# Altium schematic sheet USB-IRIS-W1_INTERFACE.SchDoc
size A3; Date: 7/24/2020; CompanyName: U-blox; DrawnBy: EMOO; Engineer: EMOO; Organization: U-blox; Address1: 3950 Fairview Industrial Dr SE #100; Address2: Salem, OR 97302; DocumentNumber: 3; SheetNumber: 3; SheetTotal: 4; SheetSize: B; SheetTitle: Connectors
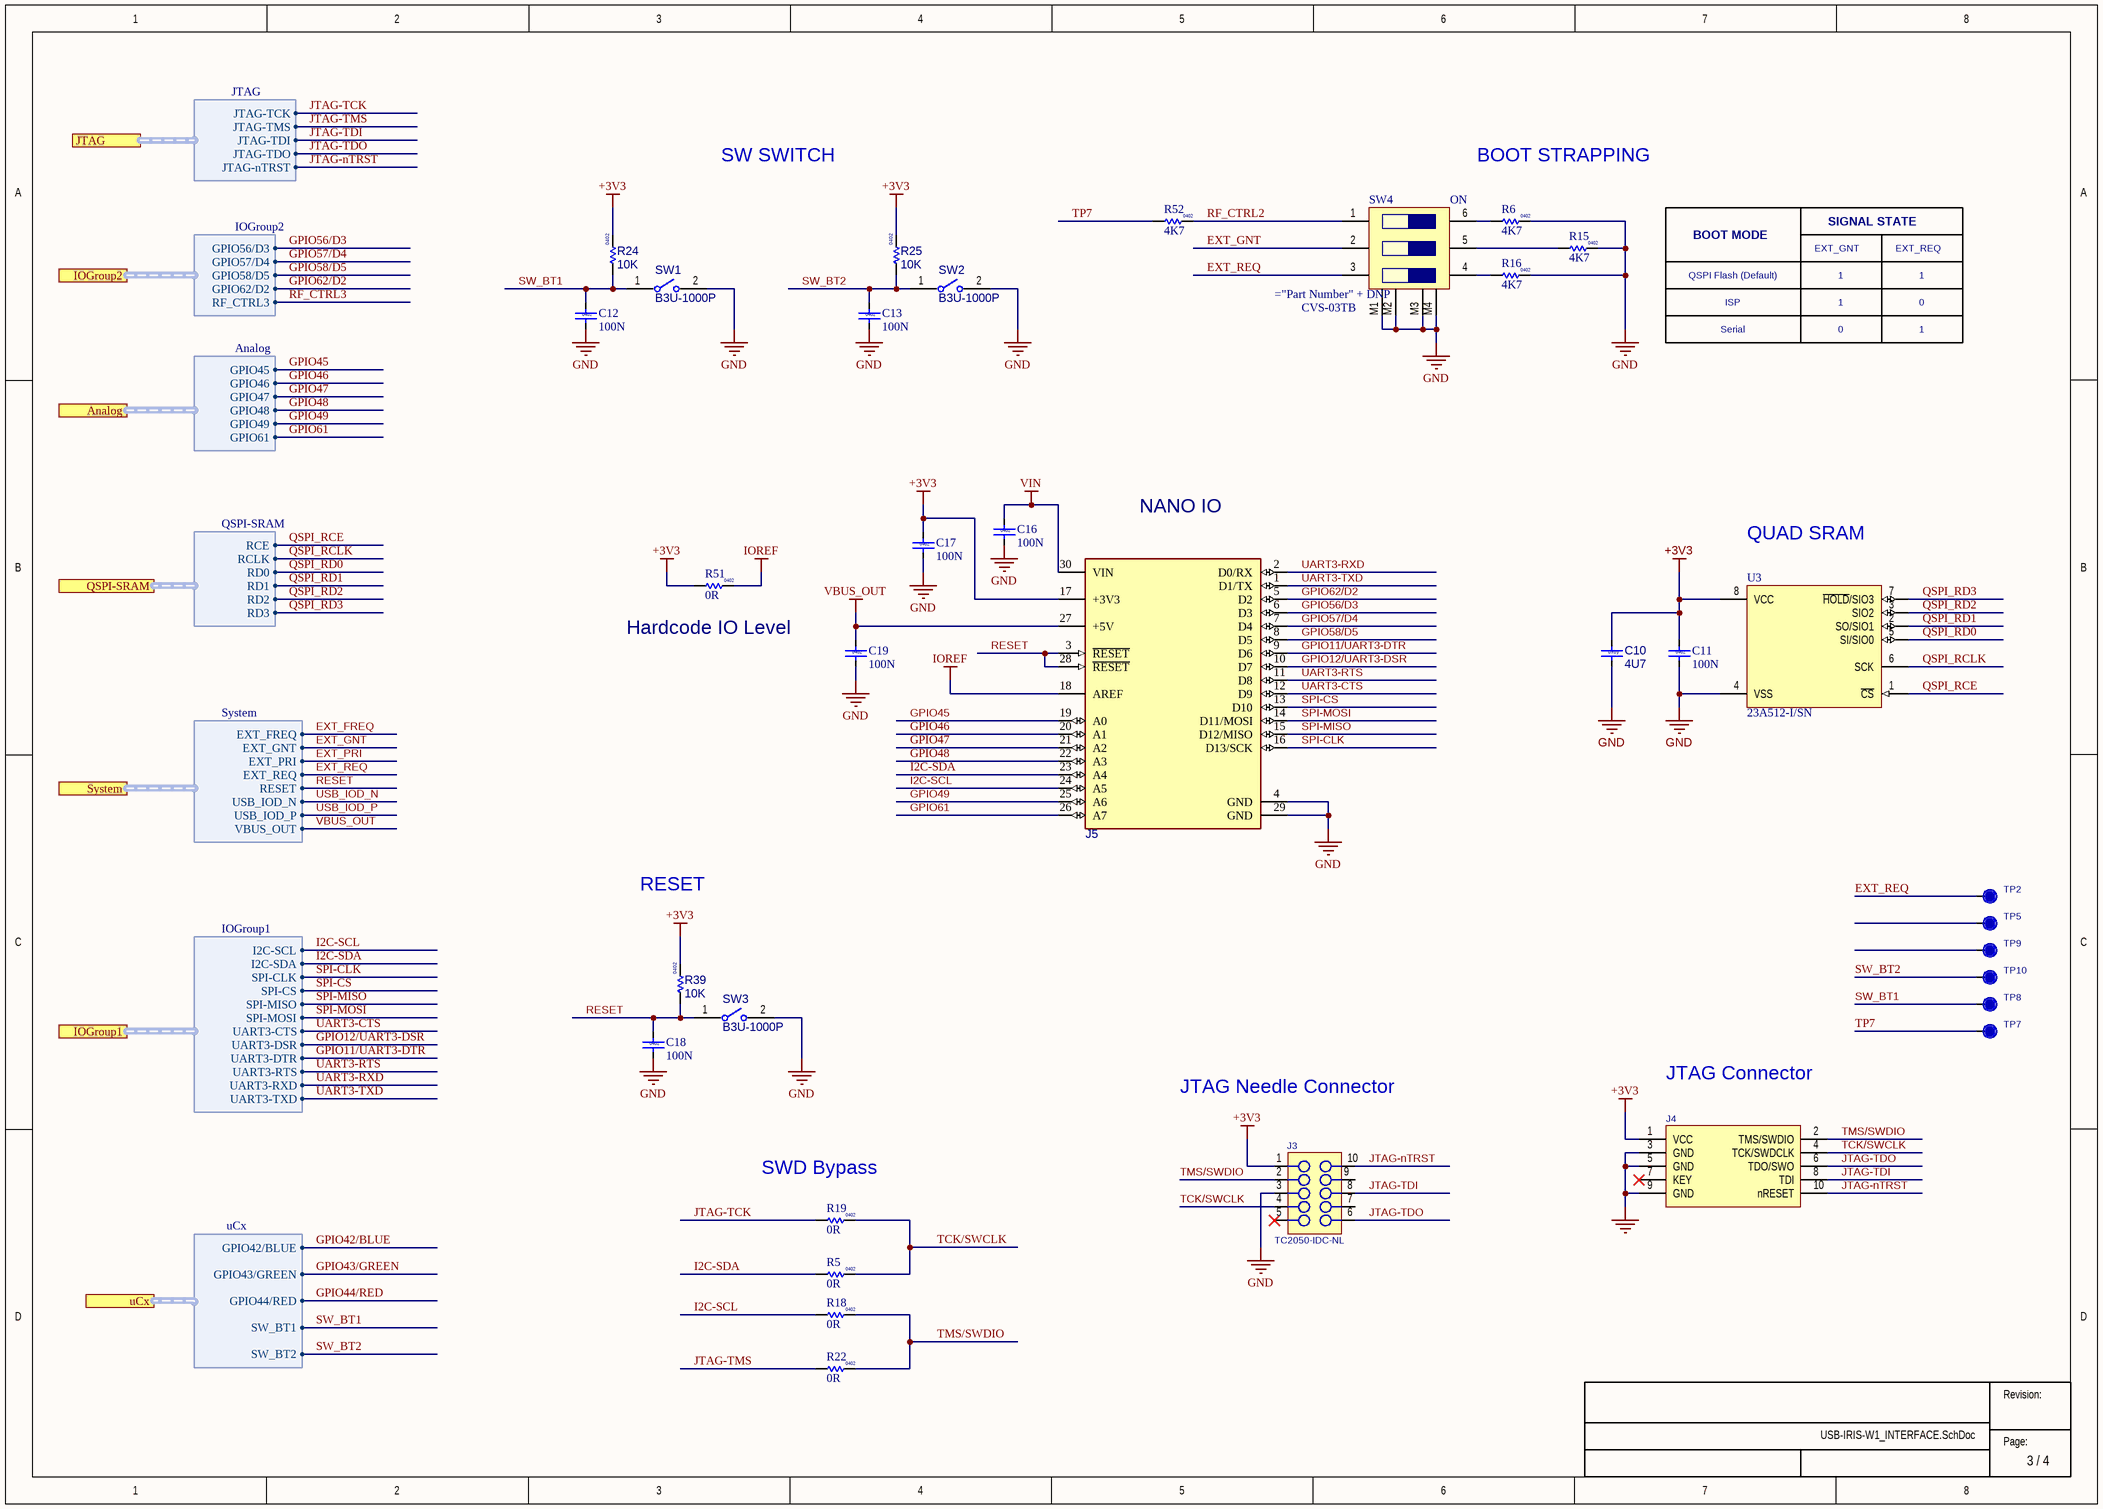
[diagram p0: USB-IRIS-W1_INTERFACE.SchDoc]

## Parts
C10  value 4U7  Size: 0x0y  [Cap 0402 HD]  (no BOM)
C11  value 100N  Size: 0402  [Cap 0402 HD]
C12  value 100N  Size: 0402  [Cap 0402]
C13  value 100N  Size: 0402  [Cap 0402]
C16  value 100N  Size: 0402  [Cap 0402 HD]
C17  value 100N  Size: 0402  [Cap 0402 HD]
C18  value 100N  Size: 0402  [Cap 0402]
C19  value 100N  Size: 0402  [Cap 0402 HD]
J3  TC2050-IDC-NLDNP  [TC2050-IDC-NL]  (value not drawn)  (no BOM)
J4  130-00099  [HDR.050P-10Pin-2x5-SMT_Key]  (value not drawn)
J5  UNK_Arduino  [UNK_Arduino]  (value not drawn)
R5  value 0R  Size: 0402  [RES_0402_1100Lx600Wx400H_500x600Pad_400G_FLX]
R6  value 4K7  Size: 0402  [RES_0402_1100Lx600Wx400H_500x600Pad_400G_FLX]
R15  value 4K7  Size: 0402  [RES_0402_1100Lx600Wx400H_500x600Pad_400G_FLX]
R16  value 4K7  Size: 0402  [RES_0402_1100Lx600Wx400H_500x600Pad_400G_FLX]
R18  value 0R  Size: 0402  [RES_0402_1100Lx600Wx400H_500x600Pad_400G_FLX]
R19  value 0R  Size: 0402  [RES_0402_1100Lx600Wx400H_500x600Pad_400G_FLX]
R22  value 0R  Size: 0402  [RES_0402_1100Lx600Wx400H_500x600Pad_400G_FLX]
R24  value 10K  Size: 0402  [RES 0402 HD]
R25  value 10K  Size: 0402  [RES 0402 HD]
R39  value 10K  Size: 0402  [RES 0402 HD]
R51  value 0R  Size: 0402  [RES_0402_1100Lx600Wx400H_500x600Pad_400G_FLX]
R52  value 4K7  Size: 0402  [RES_0402_1100Lx600Wx400H_500x600Pad_400G_FLX]
SW1  B3U-1000P  [FP-B3U-1000P-MFG]
SW2  B3U-1000P  [FP-B3U-1000P-MFG]
SW3  B3U-1000P  [FP-B3U-1000P-MFG]
SW4  (no value)  [CVS-03]
TP2  TP  [TP10R]  (value not drawn)  (no BOM)
TP5  TP  [TP10R]  (value not drawn)  (no BOM)
TP7  TP  [TP10R]  (value not drawn)  (no BOM)
TP8  TP  [TP10R]  (value not drawn)  (no BOM)
TP9  TP  [TP10R]  (value not drawn)  (no BOM)
TP10  TP  [TP10R]  (value not drawn)  (no BOM)
U3  23A512-I/SN  [SOIC127P599X173-8N]  (no BOM)

## Ports
Analog (harness Analog), IOGroup1 (harness IOGroup1), IOGroup2 (harness IOGroup2), JTAG (harness JTAG), QSPI-SRAM (harness QSPI-SRAM), System (harness System), uCx (harness uCx)

## Harnesses
JTAG: JTAG-TCK, JTAG-TMS, JTAG-TDI, JTAG-TDO, JTAG-nTRST
QSPI-SRAM: RCE, RCLK, RD0, RD1, RD2, RD3
IOGroup2: GPIO56/D3, GPIO57/D4, GPIO58/D5, GPIO62/D2, RF_CTRL3
Analog: GPIO45, GPIO46, GPIO47, GPIO48, GPIO49, GPIO61
uCx: GPIO42/BLUE, GPIO43/GREEN, GPIO44/RED, SW_BT1, SW_BT2
IOGroup1: I2C-SCL, I2C-SDA, SPI-CLK, SPI-CS, SPI-MISO, SPI-MOSI, UART3-CTS, UART3-DSR, UART3-DTR, UART3-RTS, UART3-RXD, UART3-TXD
System: EXT_FREQ, EXT_GNT, EXT_PRI, EXT_REQ, RESET, USB_IOD_N, USB_IOD_P, VBUS_OUT

## Nets
+3V3: C10.1 C11.1 C17.1 J3.1 J4.1(VCC) J5.17(+3V3) R24.2 R25.2 R39.2 R51.1 U3.8(VCC)
GND: C10.2 C11.2 C12.2 C13.2 C16.2 C17.2 C18.2 C19.2 J3.3 J4.3(GND) J4.5(GND) J4.9(GND) J5.4(GND) J5.29(GND) R6.2 R15.2 R16.2 SW1.2 SW2.2 SW3.2 SW4.M1 SW4.M2 SW4.M3 SW4.M4 U3.4(VSS)
IOREF: J5.18(AREF) R51.2
VBUS_OUT: C19.1 J5.27(+5V) ; port System.VBUS_OUT
VIN: C16.1 J5.30(VIN)
EXT_FREQ: port System.EXT_FREQ
EXT_GNT: SW4.2 ; port System.EXT_GNT
EXT_PRI: port System.EXT_PRI
EXT_REQ: SW4.3 TP2.1 ; port System.EXT_REQ
GPIO11/UART3-DTR: J5.9(D6) ; port IOGroup1.UART3-DTR
GPIO12/UART3-DSR: J5.10(D7) ; port IOGroup1.UART3-DSR
GPIO42/BLUE: port uCx.GPIO42/BLUE
GPIO43/GREEN: port uCx.GPIO43/GREEN
GPIO44/RED: port uCx.GPIO44/RED
GPIO45: J5.19(A0) ; port Analog.GPIO45
GPIO46: J5.20(A1) ; port Analog.GPIO46
GPIO47: J5.21(A2) ; port Analog.GPIO47
GPIO48: J5.22(A3) ; port Analog.GPIO48
GPIO49: J5.25(A6) ; port Analog.GPIO49
GPIO56/D3: J5.6(D3) ; port IOGroup2.GPIO56/D3
GPIO57/D4: J5.7(D4) ; port IOGroup2.GPIO57/D4
GPIO58/D5: J5.8(D5) ; port IOGroup2.GPIO58/D5
GPIO61: J5.26(A7) ; port Analog.GPIO61
GPIO62/D2: J5.5(D2) ; port IOGroup2.GPIO62/D2
I2C-SCL: J5.24(A5) R18.1 ; port IOGroup1.I2C-SCL
I2C-SDA: J5.23(A4) R5.1 ; port IOGroup1.I2C-SDA
JTAG-nTRST: J3.10 J4.10(nRESET) ; port JTAG.JTAG-nTRST
JTAG-TCK: R19.1 ; port JTAG.JTAG-TCK
JTAG-TDI: J3.8 J4.8(TDI) ; port JTAG.JTAG-TDI
JTAG-TDO: J3.6 J4.6(TDO/SWO) ; port JTAG.JTAG-TDO
JTAG-TMS: R22.1 ; port JTAG.JTAG-TMS
QSPI_RCE: U3.1(~{CS}) ; port QSPI-SRAM.RCE
QSPI_RCLK: U3.6(SCK) ; port QSPI-SRAM.RCLK
QSPI_RD0: U3.5(SI/SIO0) ; port QSPI-SRAM.RD0
QSPI_RD1: U3.2(SO/SIO1) ; port QSPI-SRAM.RD1
QSPI_RD2: U3.3(SIO2) ; port QSPI-SRAM.RD2
QSPI_RD3: U3.7(~{HOLD}/SIO3) ; port QSPI-SRAM.RD3
RESET: C18.1 J5.3(~{RESET}) J5.28(~{RESET}) R39.1 SW3.1 ; port System.RESET
RF_CTRL2: R52.2 SW4.1
RF_CTRL3: port IOGroup2.RF_CTRL3
SPI-CLK: J5.16(D13/SCK) ; port IOGroup1.SPI-CLK
SPI-CS: J5.13(D10) ; port IOGroup1.SPI-CS
SPI-MISO: J5.15(D12/MISO) ; port IOGroup1.SPI-MISO
SPI-MOSI: J5.14(D11/MOSI) ; port IOGroup1.SPI-MOSI
SW_BT1: C12.1 R24.1 SW1.1 TP8.1 ; port uCx.SW_BT1
SW_BT2: C13.1 R25.1 SW2.1 TP10.1 ; port uCx.SW_BT2
TCK/SWCLK: J3.4 J4.4(TCK/SWDCLK) R5.2 R19.2
TMS/SWDIO: J3.2 J4.2(TMS/SWDIO) R18.2 R22.2
TP7: R52.1 TP7.1
UART3-CTS: J5.12(D9) ; port IOGroup1.UART3-CTS
UART3-RTS: J5.11(D8) ; port IOGroup1.UART3-RTS
UART3-RXD: J5.2(D0/RX) ; port IOGroup1.UART3-RXD
UART3-TXD: J5.1(D1/TX) ; port IOGroup1.UART3-TXD
USB_IOD_N: port System.USB_IOD_N
USB_IOD_P: port System.USB_IOD_P
NetR6_1: R6.1 SW4.6
NetR15_1: R15.1 SW4.5
NetR16_1: R16.1 SW4.4

Not connected (* = marked no-connect by the designer): J3 5* 7 9; J4 7(KEY)*; TP5 1; TP9 1

## Notes on the sheet
- SW SWITCH
- BOOT STRAPPING
- BOOT MODE
- EXT_GNT
- SIGNAL STATE
- EXT_REQ
- QSPI Flash (Default)
- ISP
- 1
- 0
- Serial
- NANO IO
- QUAD SRAM
- (near R51) Hardcode IO Level
- RESET
- JTAG Needle Connector
- JTAG Connector
- (near R19) SWD Bypass
- Revision:
- Page:
- (in symbol CVS-03TB) ON

## Library data of the parts
C10 = UBXH01-0000243: CAP CER X5R 0402; Manufacturer: Murata Manufacturing Company, Ltd.; Manufacturer P/N: GRM155R61A475MEAA; Tolerance: 20%; Max Voltage: 10.0V; Editor: dario.antonaz; Released by: pasquale.scorca; Env: ROHS; Permitted Use: Volume Products; Perferred: PREF; Mfg P/N Status: Active; Mfg P/N Split: 100; Mfg P/N Released: Yes; Part Number: UBXH01-0000243; Min Operating Temp: -40°C; Max Operating Temp: 85°C; Part Type: Capacitor; Release Data: 2016-03-17 10:02:21.014314; UBX Wiki: https://wiki.u-blox.com/bin/view/Operations/PartDetails?index=24303; RefDes: C; Mfg P/N Datasheet: https://wiki.u-blox.com/bin/view/Generic/Docs/DocumentSummary?index=24302
C11-C13 C16-C19 = UBXH01-2021002: CAP CER X5R 0402 100N 10% 10V; Manufacturer: Murata Manufacturing Company, Ltd.; Manufacturer P/N: GRM155R61A104KA01; Editor: roland.rust; Env: GREEN; Permitted Use: Volume Products; Perferred: PREF; Mfg P/N Status: NRND; Mfg P/N Split: 100; Mfg P/N Released: Yes; Part Number: UBXH01-2021002; Tolerance: 10%; Max Voltage: 10V; Part Type: Capacitor; Released by: roland.rust; Release Data: 2005-07-22T13:59:44; UBX Wiki: https://wiki.u-blox.com/bin/view/Operations/PartDetails?index=5759; RefDes: C; Manufacturer 2: Samsung Electro-Mechanics; Manufacturer P/N 2: CL05A104KP5NNN; Mfg P/N Status 2: Active; Mfg P/N Split 2: 0; Mfg P/N Released 2: Yes; Mfg P/N Datasheet 2: https://wiki.u-blox.com/bin/view/Generic/Docs/DocumentSummary?index=28113
J3 = TC2050-IDC-NL: CON PADS FOR CBL PLUG-OF-NAILS 10-PIN NO LEGS; Manufacturer: TAG Connect; Added By: Paul B; Manufacturer P/N: TC2050-IDC-NL; Part Number: TC2050-IDC-NL; Size: 6.1mm x 9.9mm; Height: 0; DNP: DNP; Added Date: 12/3/2015
J4 = 130-00099: Header 0.05" 10Pin 2Row SMD Black; Part Name: CON HDR 0.05" 10Pin 2Row SMD Black; Part_Type: Connector; Manufacturer: Samtec; Manufacturer P/N: FTSH-105-01-F-DV-K; Item_Phase: Pre-Production; Component Mounting Type: SMT; Keyed: Yes; Locking: No; Pin Pitch: 0.050"; Rows: 2; Part Number: 130-00099; Revision: 1; Supplier 1: Digi-Key; Supplier Part Number 1: SAM8796-ND; Arena Link: https://app.bom.com/a/5N6EKRARATS7TSHL?v=spec.summary; Color: Black; Connector Type: Header; Height: 6mm; Length: 12.75mm; Pins: 10; Use in new designs: Yes; Width: 4.78
J5 = UBXH04-0000717: ARDUINO NANO 33 IOT CONN; Editor: aneeb.sohail; Env: ROHS; Permitted Use: Support Products; Perferred: PREF; Part Number: UBXH04-0000717; Min Operating Temp: -40°C; Max Operating Temp: 85°C; Part Type: Connector; UBX Wiki: https://wiki.u-blox.com/bin/view/Operations/PartDetails?index=35490; RefDes: J
R5 R18 R19 R22 R51 = UBXH18-0003002: RES THICK FILM CHIP 0402 0R 0 100mW; Manufacturer: KOA; Manufacturer P/N: RK73Z1ETTD; Tolerance: 0; Editor: charlotte.biber; Released by: peter.mueller; Env: ROHS; Permitted Use: Volume Products; Perferred: PREF; Mfg P/N Status: NRND; Mfg P/N Split: 100; Mfg P/N Released: Yes; Part Number: UBXH18-0003002; Max Power: 100mW; Part Type: Resistor; Release Data: 2012-06-05T09:49:55; UBX Wiki: https://wiki.u-blox.com/bin/view/Operations/PartDetails?index=6611; RefDes: R; Manufacturer 2: YAGEO; Manufacturer P/N 2: 2322_705_91001_L; Mfg P/N Status 2: Obsolete; Mfg P/N Split 2: 0; Mfg P/N Released 2: Yes
R6 R15 R16 R52 = UBXH18-0008065: RES THICK FILM CHIP 0402 4K7 5% 100mW; Manufacturer: YAGEO; Manufacturer P/N: 2322_705_70472_L; Editor: martin.frauchiger; Env: ROHS; Permitted Use: Volume Products; Perferred: PREF; Mfg P/N Status: NRND; Mfg P/N Split: 100; Mfg P/N Released: Yes; Part Number: UBXH18-0008065; Tolerance: 5%; Max Power: 100mW; Part Type: Resistor; Released by: martin.frauchiger; Release Data: 2005-08-19T10:42:45; UBX Wiki: https://wiki.u-blox.com/bin/view/Operations/PartDetails?index=6969; RefDes: R; Manufacturer 2: KOA; Manufacturer P/N 2: RK73B1ETTD472J; Mfg P/N Status 2: NRND; Mfg P/N Split 2: 0; Mfg P/N Released 2: Yes
R24 R25 R39 = UBXH18-0008073: RES THICK FILM CHIP 0402 10K 5% 100mW; Manufacturer: YAGEO; Manufacturer P/N: 2322_705_87103_L; Editor: martin.frauchiger; Env: ROHS; Permitted Use: Volume Products; Perferred: PREF; Mfg P/N Status: NRND; Mfg P/N Split: 0; Mfg P/N Released: Yes; Part Number: UBXH18-0008073; Tolerance: 5%; Max Power: 100mW; Part Type: Resistor; Released by: martin.frauchiger; Release Data: 2005-08-19 10:42:45; UBX Wiki: https://wiki.u-blox.com/bin/view/Operations/PartDetails?index=6981; RefDes: R
SW1-SW3 = CMP-2100-03586-2: SWITCH TACTILE SPST-NO 0.05A 12V; Contact Resistance: 100mR; Operating Force: 1.5N; Max Current Rating: 50mA; Switch Travel: 0.15mm; Actuator Type: Standard; Mechanical Life: 200000Cycles; Ratings: Dust Proof; Illumination Type: Non-Illuminated; Throw Configuration: SPST; Actuator Length: 0.4mm; Switch Function: Off-Mom; Height: 1.2mm; Width: 3mm; Weight: 0.000776oz; Contact Material: Silver; Max Voltage Rating (DC): 12V; Insulation Resistance: 100MR; Lead Free: Lead Free; Current Rating: 50mA; Termination: SMD/SMT; Length: 4mm; Voltage Rating (DC): 12V; Contact Current Rating: 50mA; Orientation: Straight; Depth: 2.5mm; Max Operating Temperature: 70°C; Packaging: Tape and Reel; Min Operating Temperature: -25°C; Package Quantity: 1; Mount: Surface Mount; Electrical Life: 200000Cycles
SW4 = CVS-03TB: Dip Switch SPST 3 Position Surface Mount Slide (Standard) Actuator 100mA 6VDC; Part Number: UBXH19-0000036; Manufacturer 1: Nidec Components Corporation; Item_Phase: Active; Component Mounting Type: SMT; Switch/Button Function: On-Off; Use in new designs: Yes; Voltage: 6V; Item Phase: Unreleased; UBX Code: None; Part Name: CVS-03TB; Part_Type: Switch; Revision: A; Supplier 1: Digi-Key; Supplier Part Number 1: 563-1194-1-ND; Arena Link: https://app.bom.com/a/4M5DJQ9Q9SR7OCE3?v=spec.summary; Current: 100mA; Height: 1.45mm; Length: 6.1mm; Pins: 6; Switch/Button Circuit: SPST; Width: 6.2mm; Max Operating Temp: 85; Min Operating Temp: -40; Manufacturer 2: None; Manufacturer Part Number 2: None; Supplier 2: None; Supplier Part Number 2: None; Manufacturer Part Number 1: CVS-03TB
TP2 TP5 TP7-TP10 = TP10R: Testpoint, Round 1.0mm Dia; Added By: Jeremy D; Part Number: TP10R; Size: 1.0mm; Height: 0; DNP: DNP; Added Date: 2/1/2015; Checked By: Paul B; Checked Date: 2/5/2015
U3 = 23A512-I/SN: IC SRAM 512KBIT SPI/QUAD 8SOIC; Manufacturer: Microchip Technology; Memory Size: 512kb; Memory Interface: Qaud SPI; Manufacturer Part Number: 23A512-I/SN; Technology: SRAM; Package / Case: 8-SOIC (0.154", 3.90mm Width); Supplier 1: Digi-Key; Supplier Part Number 1: 23A512-I/SN-ND